# Altium project Jam2M.PrjPcb (part 1 of 3)
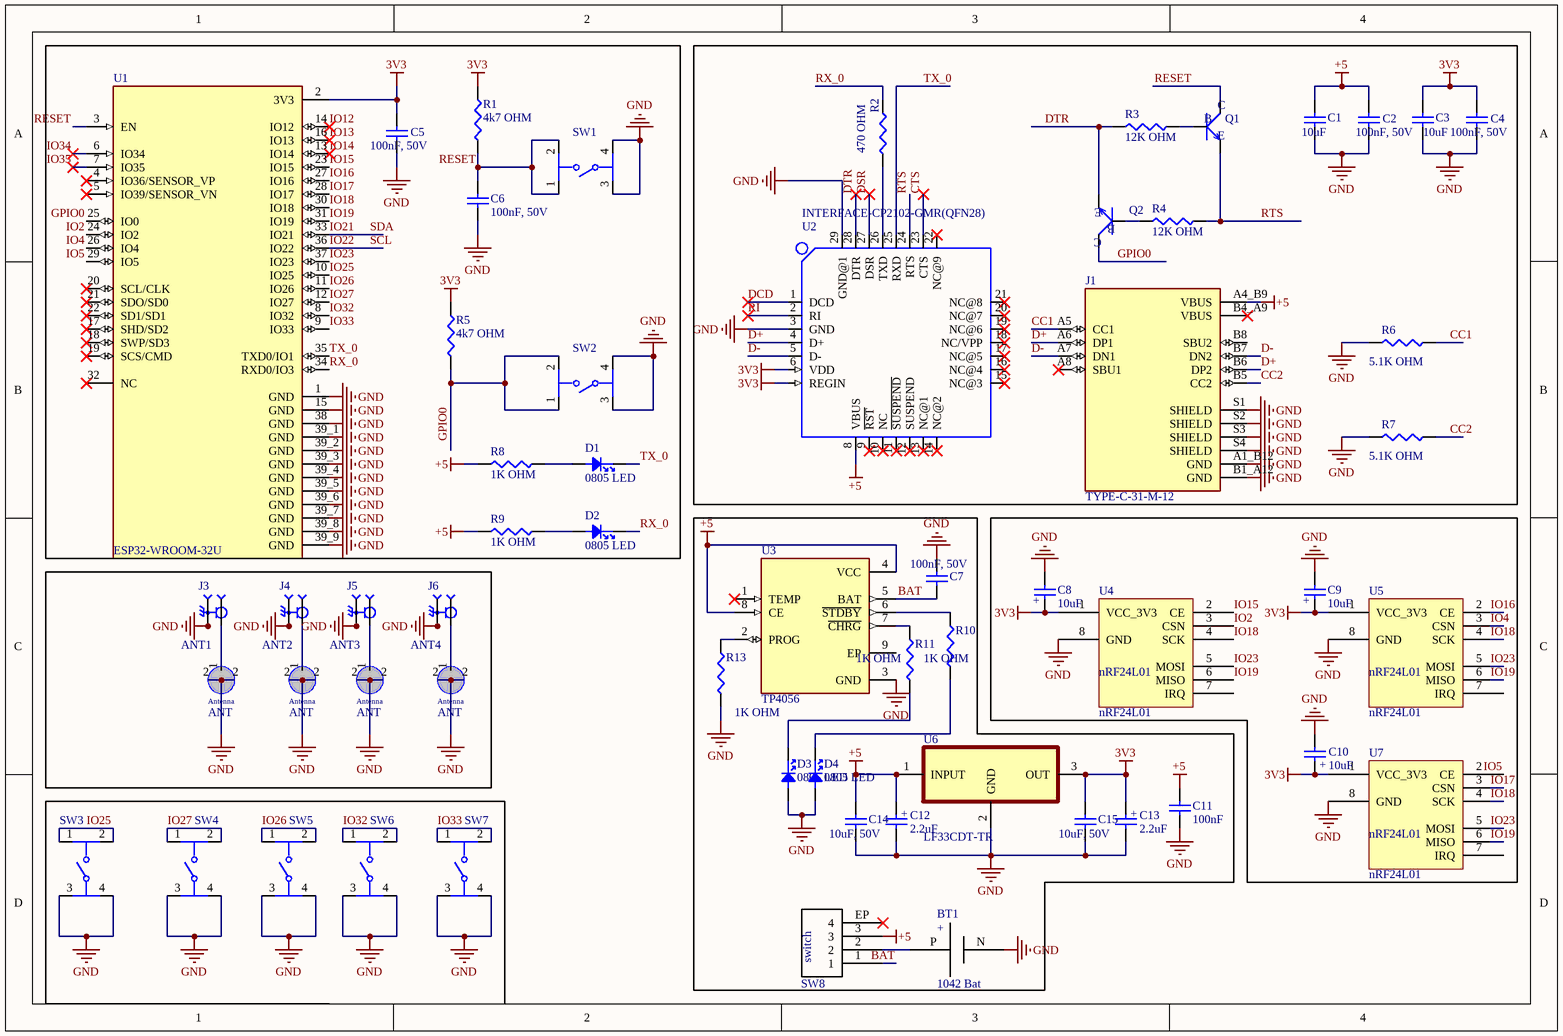
[diagram p0: Sheet1.SchDoc]
2 sheets, 69 parts. Net scope: global (net labels, ports and power ports of the same name join across sheets).
Board file: PCB1.PcbDoc
Sheets:
  Sheet1.SchDoc
  Sheet2.SchDoc

## Sheet Sheet1.SchDoc
size A4; SheetNumber: 1; SheetTotal: 2

### Parts
ANT1  ANT  [U.FL SMD]
ANT2  ANT  [U.FL SMD]
ANT3  ANT  [U.FL SMD]
ANT4  ANT  [U.FL SMD]
BT1  1042 Bat  [BAT_1042]
C1  10uF  [CAP0805]
C2  100nF, 50V  [CAP0805]
C3  10uF  [CAP0805]
C4  100nF, 50V  [CAP0805]
C5  100nF, 50V  [CAP0805]
C6  100nF, 50V  [CAP0805]
C7  100nF, 50V  [CAP0805]
C8  10uF  [Tan 1206 (3216X18L) Size A]
C9  10uF  [Tan 1206 (3216X18L) Size A]
C10  10uF  [Tan 1206 (3216X18L) Size A]
C11  100nF  [CAP0805]
C12  2.2uF  [Tan 1206 (3216X18L) Size A]
C13  2.2uF  [Tan 1206 (3216X18L) Size A]
C14  10uF, 50V  [CAP 1206 (3216X15L)]
C15  10uF, 50V  [CAP 1206 (3216X15L)]
D1  0805 LED  [L0805]
D2  0805 LED  [L0805]
D3  0805 LED  [L0805]
D4  0805 LED  [L0805]
J1  TYPE-C-31-M-12  [HRO_TYPE-C-31-M-12]
J3  SMA-J-P-H-ST-EM1  [SAMTEC_SMA-J-P-H-ST-EM1]  (value not drawn)
J4  SMA-J-P-H-ST-EM1  [SAMTEC_SMA-J-P-H-ST-EM1]  (value not drawn)
J5  SMA-J-P-H-ST-EM1  [SAMTEC_SMA-J-P-H-ST-EM1]  (value not drawn)
J6  SMA-J-P-H-ST-EM1  [SAMTEC_SMA-J-P-H-ST-EM1]  (value not drawn)
Q1  SMD-TRANSISTORS-NPN-25V-500MW(SOT-23)  [SOT-23]  (value not drawn)
Q2  SMD-TRANSISTORS-NPN-25V-500MW(SOT-23)  [SOT-23]  (value not drawn)
R1  4k7 OHM  [RES 0805]
R2  470 OHM  [RES 0805]
R3  12K OHM  [RES 0805]
R4  12K OHM  [RES 0805]
R5  4k7 OHM  [RES 0805]
R6  5.1K OHM  [RES 0805]
R7  5.1K OHM  [RES 0805]
R8  1K OHM  [RES 0805]
R9  1K OHM  [RES 0805]
R10  1K OHM  [RES 0805]
R11  1K OHM  [RES 0805]
R13  1K OHM  [RES 0805]
SW1  PTS645SH50SMTR92LFS  [FP-PTS645SH50SMTR92LFS-MFG]  (value not drawn)
SW2  PTS645SH50SMTR92LFS  [FP-PTS645SH50SMTR92LFS-MFG]  (value not drawn)
SW3  PTS645SH50SMTR92LFS  [FP-PTS645SH50SMTR92LFS-MFG]  (value not drawn)
SW4  PTS645SH50SMTR92LFS  [FP-PTS645SH50SMTR92LFS-MFG]  (value not drawn)
SW5  PTS645SH50SMTR92LFS  [FP-PTS645SH50SMTR92LFS-MFG]  (value not drawn)
SW6  PTS645SH50SMTR92LFS  [FP-PTS645SH50SMTR92LFS-MFG]  (value not drawn)
SW7  PTS645SH50SMTR92LFS  [FP-PTS645SH50SMTR92LFS-MFG]  (value not drawn)
SW8  SWSLIDT_SPDT_MSS3  [SWSLIDT_SPDT_MSS3]  (value not drawn)
U1  ESP32-WROOM-32U  [XCVR_ESP32-WROOM-32U]
U2  INTERFACE-CP2102-GMR(QFN28)  [QFN28G_0.5-5X5MM]
U3  TP4056  [SOP127P600X175-9N]
U4  nRF24L01  [NRF24L01_GT24MINI_MS]
U5  nRF24L01  [NRF24L01_GT24MINI_MS]
U6  LF33CDT-TR  [TO228P972X240-3N]
U7  nRF24L01  [NRF24L01_GT24MINI_MS]

### Nets
3V3: C3.2 C4.2 C5.2 C8.1 C9.1 C10.2 C13.1 C15.2 R1.2 R5.2 U1.2(3V3) U2.6(VDD) U2.7(REGIN) U4.1(VCC_3V3) U5.1(VCC_3V3) U6.3(OUT) U7.1(VCC_3V3)
+5: C1.2 C2.2 C11.2 C12.1 C14.2 J1.A4_B9(VBUS) R8.1 R9.1 SW8.3 U2.8(VBUS) U3.4(VCC) U3.8(CE) U6.1(INPUT)
GND: ANT1.2 ANT2.2 ANT3.2 ANT4.2 BT1.N C1.1 C2.1 C3.1 C4.1 C5.1 C6.1 C7.1 C8.2 C9.2 C10.1 C11.1 C12.2 C13.2 C14.1 C15.1 D3.A D4.A J1.A1_B12(GND) J1.B1_A12(GND) J1.S1(SHIELD) J1.S2(SHIELD) J1.S3(SHIELD) J1.S4(SHIELD) J3.2_1 J3.2_2 J3.3_1 J3.3_2 J4.2_1 J4.2_2 J4.3_1 J4.3_2 J5.2_1 J5.2_2 J5.3_1 J5.3_2 J6.2_1 J6.2_2 J6.3_1 J6.3_2 R6.1 R7.1 R13.1 SW1.3 SW1.4 SW2.3 SW2.4 SW3.3 SW3.4 SW4.3 SW4.4 SW5.3 SW5.4 SW6.3 SW6.4 SW7.3 SW7.4 U1.1(GND) U1.15(GND) U1.38(GND) U1.39_1(GND) U1.39_2(GND) U1.39_3(GND) U1.39_4(GND) U1.39_5(GND) U1.39_6(GND) U1.39_7(GND) U1.39_8(GND) U1.39_9(GND) U2.3(GND) U2.29(GND@1) U3.3(GND) U4.8(GND) U5.8(GND) U6.2(GND) U7.8(GND)
BAT: C7.2 SW8.1 U3.5(BAT)
CC1: J1.A5(CC1) R6.2
CC2: J1.B5(CC2) R7.2
CTS: U2.23(CTS)
D+: J1.A6(DP1) J1.B6(DP2) U2.4(D+)
D-: J1.A7(DN1) J1.B7(DN2) U2.5(D-)
DCD: U2.1(DCD)
DSR: U2.27(DSR)
DTR: Q2.2(E) R3.1 U2.28(DTR)
GPIO0: Q2.3(C) R5.1 SW2.1 SW2.2 U1.25(IO0)
IO2: U1.24(IO2) U4.3(CSN)
IO4: U1.26(IO4) U5.3(CSN)
IO5: U1.29(IO5) U7.2(CE)
IO12: U1.14(IO12)
IO13: U1.16(IO13)
IO14: U1.13(IO14)
IO15: U1.23(IO15) U4.2(CE)
IO16: U1.27(IO16) U5.2(CE)
IO17: U1.28(IO17) U7.3(CSN)
IO18: U1.30(IO18) U4.4(SCK) U5.4(SCK) U7.4(SCK)
IO19: U1.31(IO19) U4.6(MISO) U5.6(MISO) U7.6(MISO)
IO21: U1.33(IO21)  [also labelled SDA]
IO22: U1.36(IO22)  [also labelled SCL]
IO23: U1.37(IO23) U4.5(MOSI) U5.5(MOSI) U7.5(MOSI)
IO25: SW3.1 SW3.2 U1.10(IO25)
IO26: SW5.1 SW5.2 U1.11(IO26)
IO27: SW4.1 SW4.2 U1.12(IO27)
IO32: SW6.1 SW6.2 U1.8(IO32)
IO33: SW7.1 SW7.2 U1.9(IO33)
IO34: U1.6(IO34)
IO35: U1.7(IO35)
RESET: C6.2 Q1.3(C) R1.1 SW1.1 SW1.2 U1.3(EN)
RI: U2.2(RI)
RTS: Q1.2(E) R4.2 U2.24(RTS)
RX_0: D2.k R2.2 U1.34(RXD0/IO3)
TX_0: D1.k U1.35(TXD0/IO1) U2.25(RXD)
NetANT1_1: ANT1.1 J3.1
NetANT2_1: ANT2.1 J4.1
NetANT3_1: ANT3.1 J5.1
NetANT4_1: ANT4.1 J6.1
NetBT1_P: BT1.P SW8.2
NetD1_A: D1.A R8.2
NetD2_A: D2.A R9.2
NetD3_k: D3.k R11.1
NetD4_k: D4.k R10.2
NetQ1_1: Q1.1(B) R3.2
NetQ2_1: Q2.1(B) R4.1
NetR2_1: R2.1 U2.26(TXD)
NetR10_1: R10.1 U3.6(~{STDBY})
NetR11_2: R11.2 U3.7(~{CHRG})
NetR13_2: R13.2 U3.2(PROG)

Not connected (* = marked no-connect by the designer): J1 A8(SBU1)* B4_A9(VBUS)* B8(SBU2); SW8 EP(4)*; U1 4(IO36/SENSOR_VP)* 5(IO39/SENSOR_VN)* 17(SHD/SD2)* 18(SWP/SD3)* 19(SCS/CMD)* 20(SCL/CLK)* 21(SDO/SD0)* 22(SD1/SD1)* 32(NC)*; U2 9(~{RST})* 10(NC)* 11(~{SUSPEND})* 12(SUSPEND)* 13(NC@1)* 14(NC@2)* 15(NC@3)* 16(NC@4)* 17(NC@5)* 18(NC/VPP)* 19(NC@6)* 20(NC@7)* 21(NC@8)* 22(NC@9)*; U3 1(TEMP)* 9(EP); U4 7(IRQ); U5 7(IRQ); U7 7(IRQ)